# EAGLE schematic Switchout (EAGLE 6.6.0)
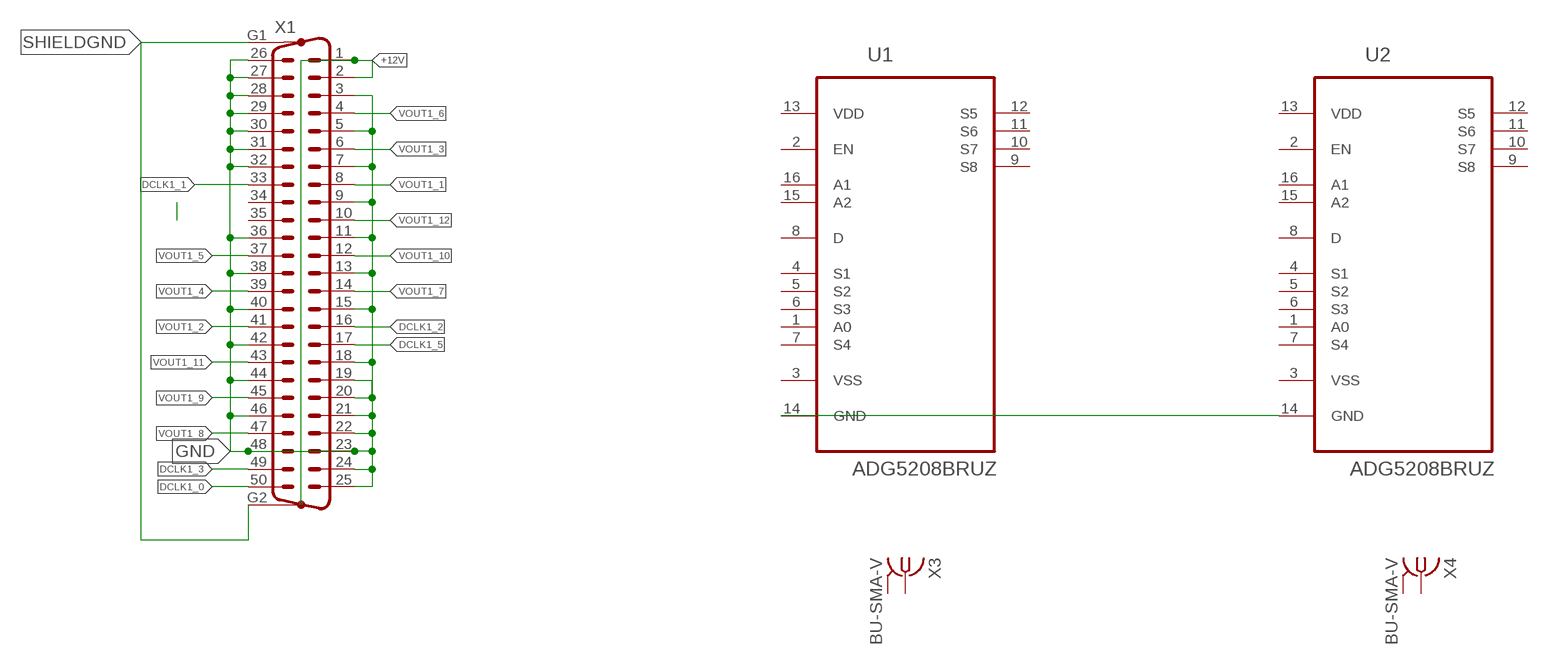
[diagram p0: schematic, sheet 1]

## Parts
U1  ADG5208BRUZ  [SOP65P640X120-16N]
U2  ADG5208BRUZ  [SOP65P640X120-16N]
X1  M50VP  [M50VP]
X3  BU-SMA-V  [BU-SMA-V]
X4  BU-SMA-V  [BU-SMA-V]

## Nets
+12V: X1.1 X1.2
DCLK1_0: X1.50
DCLK1_1: X1.33
DCLK1_2: X1.16
DCLK1_3: X1.49
DCLK1_5: X1.17
GND: X1.3 X1.5 X1.7 X1.9 X1.11 X1.13 X1.15 X1.18 X1.19 X1.20 X1.21 X1.22 X1.23 X1.24 X1.25 X1.26 X1.27 X1.28 X1.29 X1.30 X1.31 X1.32 X1.36 X1.38 X1.40 X1.42 X1.44 X1.46 X1.48
N$1: U1.14(GND) U2.14(GND)
SHIELDGND: X1.G1 X1.G2
VOUT1_1: X1.8
VOUT1_2: X1.41
VOUT1_3: X1.6
VOUT1_4: X1.39
VOUT1_5: X1.37
VOUT1_6: X1.4
VOUT1_7: X1.14
VOUT1_8: X1.47
VOUT1_9: X1.45
VOUT1_10: X1.12
VOUT1_11: X1.43
VOUT1_12: X1.10
Unconnected: U1.1(A0) U1.2(EN) U1.4(S1) U1.5(S2) U1.6(S3) U1.7(S4) U1.8(D) U1.9(S8) U1.10(S7) U1.11(S6) U1.12(S5) U1.15(A2) U1.16(A1) U2.1(A0) U2.2(EN) U2.4(S1) U2.5(S2) U2.6(S3) U2.7(S4) U2.8(D) U2.9(S8) U2.10(S7) U2.11(S6) U2.12(S5) U2.15(A2) U2.16(A1) X1.34 X1.35 X3.1 X3.2 X3.3 X3.4 X3.5 X4.1 X4.2 X4.3 X4.4 X4.5

## Power pins joined to a net without a drawn wire
VDD: U1.13(VDD) U2.13(VDD)
VSS: U1.3(VSS) U2.3(VSS)

## Library data of the parts
U1 U2 = ADI-Phase-2:ADG5208BRUZ: 4-/8-Channel Multiplexers; MPN: ADG5208BRUZ; OC_FARNELL: 2008777; OC_NEWARK: 58T8823; PACKAGE: TSSOP-16; SUPPLIER: Analog Devices
X1 = con-subd:M50VP: SUB-D; OC_FARNELL: unknown; OC_NEWARK: unknown
X3 X4 = con-coax:BU-SMA-V: FEMALE SMA CONNECTOR Radiall distributor RS 112-3794; OC_FARNELL: unknown; OC_NEWARK: unknown